# EAGLE design UV-LED (EAGLE 6.5.0)
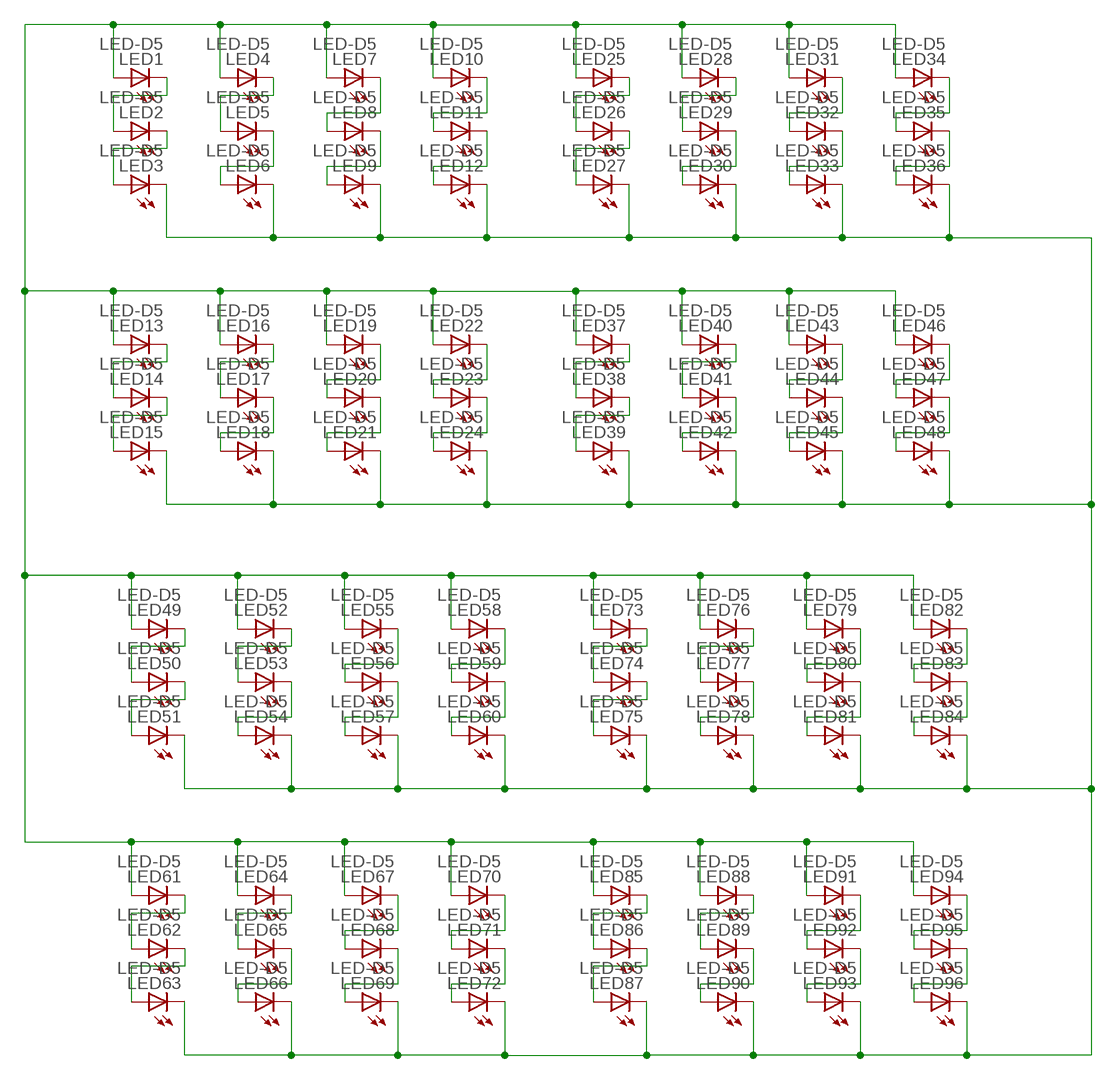
[diagram p0: schematic, sheet 1]

## Parts
LED1  LED-D5  [LED-D5]
LED2  LED-D5  [LED-D5]
LED3  LED-D5  [LED-D5]
LED4  LED-D5  [LED-D5]
LED5  LED-D5  [LED-D5]
LED6  LED-D5  [LED-D5]
LED7  LED-D5  [LED-D5]
LED8  LED-D5  [LED-D5]
LED9  LED-D5  [LED-D5]
LED10  LED-D5  [LED-D5]
LED11  LED-D5  [LED-D5]
LED12  LED-D5  [LED-D5]
LED13  LED-D5  [LED-D5]
LED14  LED-D5  [LED-D5]
LED15  LED-D5  [LED-D5]
LED16  LED-D5  [LED-D5]
LED17  LED-D5  [LED-D5]
LED18  LED-D5  [LED-D5]
LED19  LED-D5  [LED-D5]
LED20  LED-D5  [LED-D5]
LED21  LED-D5  [LED-D5]
LED22  LED-D5  [LED-D5]
LED23  LED-D5  [LED-D5]
LED24  LED-D5  [LED-D5]
LED25  LED-D5  [LED-D5]
LED26  LED-D5  [LED-D5]
LED27  LED-D5  [LED-D5]
LED28  LED-D5  [LED-D5]
LED29  LED-D5  [LED-D5]
LED30  LED-D5  [LED-D5]
LED31  LED-D5  [LED-D5]
LED32  LED-D5  [LED-D5]
LED33  LED-D5  [LED-D5]
LED34  LED-D5  [LED-D5]
LED35  LED-D5  [LED-D5]
LED36  LED-D5  [LED-D5]
LED37  LED-D5  [LED-D5]
LED38  LED-D5  [LED-D5]
LED39  LED-D5  [LED-D5]
LED40  LED-D5  [LED-D5]
LED41  LED-D5  [LED-D5]
LED42  LED-D5  [LED-D5]
LED43  LED-D5  [LED-D5]
LED44  LED-D5  [LED-D5]
LED45  LED-D5  [LED-D5]
LED46  LED-D5  [LED-D5]
LED47  LED-D5  [LED-D5]
LED48  LED-D5  [LED-D5]
LED49  LED-D5  [LED-D5]
LED50  LED-D5  [LED-D5]
LED51  LED-D5  [LED-D5]
LED52  LED-D5  [LED-D5]
LED53  LED-D5  [LED-D5]
LED54  LED-D5  [LED-D5]
LED55  LED-D5  [LED-D5]
LED56  LED-D5  [LED-D5]
LED57  LED-D5  [LED-D5]
LED58  LED-D5  [LED-D5]
LED59  LED-D5  [LED-D5]
LED60  LED-D5  [LED-D5]
LED61  LED-D5  [LED-D5]
LED62  LED-D5  [LED-D5]
LED63  LED-D5  [LED-D5]
LED64  LED-D5  [LED-D5]
LED65  LED-D5  [LED-D5]
LED66  LED-D5  [LED-D5]
LED67  LED-D5  [LED-D5]
LED68  LED-D5  [LED-D5]
LED69  LED-D5  [LED-D5]
LED70  LED-D5  [LED-D5]
LED71  LED-D5  [LED-D5]
LED72  LED-D5  [LED-D5]
LED73  LED-D5  [LED-D5]
LED74  LED-D5  [LED-D5]
LED75  LED-D5  [LED-D5]
LED76  LED-D5  [LED-D5]
LED77  LED-D5  [LED-D5]
LED78  LED-D5  [LED-D5]
LED79  LED-D5  [LED-D5]
LED80  LED-D5  [LED-D5]
LED81  LED-D5  [LED-D5]
LED82  LED-D5  [LED-D5]
LED83  LED-D5  [LED-D5]
LED84  LED-D5  [LED-D5]
LED85  LED-D5  [LED-D5]
LED86  LED-D5  [LED-D5]
LED87  LED-D5  [LED-D5]
LED88  LED-D5  [LED-D5]
LED89  LED-D5  [LED-D5]
LED90  LED-D5  [LED-D5]
LED91  LED-D5  [LED-D5]
LED92  LED-D5  [LED-D5]
LED93  LED-D5  [LED-D5]
LED94  LED-D5  [LED-D5]
LED95  LED-D5  [LED-D5]
LED96  LED-D5  [LED-D5]

## Nets
N$1: LED1.A LED4.A LED7.A LED10.A LED13.A LED16.A LED19.A LED22.A LED25.A LED28.A LED31.A LED34.A LED37.A LED40.A LED43.A LED46.A LED49.A LED52.A LED55.A LED58.A LED61.A LED64.A LED67.A LED70.A LED73.A LED76.A LED79.A LED82.A LED85.A LED88.A LED91.A LED94.A
N$3: LED1.C LED2.A
N$4: LED2.C LED3.A
N$5: LED4.C LED5.A
N$6: LED5.C LED6.A
N$7: LED7.C LED8.A
N$8: LED8.C LED9.A
N$9: LED10.C LED11.A
N$10: LED11.C LED12.A
N$13: LED13.C LED14.A
N$14: LED14.C LED15.A
N$15: LED16.C LED17.A
N$16: LED17.C LED18.A
N$17: LED19.C LED20.A
N$18: LED20.C LED21.A
N$19: LED22.C LED23.A
N$20: LED23.C LED24.A
N$22: LED3.C LED6.C LED9.C LED12.C LED15.C LED18.C LED21.C LED24.C LED27.C LED30.C LED33.C LED36.C LED39.C LED42.C LED45.C LED48.C LED51.C LED54.C LED57.C LED60.C LED63.C LED66.C LED69.C LED72.C LED75.C LED78.C LED81.C LED84.C LED87.C LED90.C LED93.C LED96.C
N$23: LED25.C LED26.A
N$24: LED26.C LED27.A
N$25: LED28.C LED29.A
N$26: LED29.C LED30.A
N$27: LED31.C LED32.A
N$28: LED32.C LED33.A
N$29: LED34.C LED35.A
N$30: LED35.C LED36.A
N$33: LED37.C LED38.A
N$34: LED38.C LED39.A
N$35: LED40.C LED41.A
N$36: LED41.C LED42.A
N$37: LED43.C LED44.A
N$38: LED44.C LED45.A
N$39: LED46.C LED47.A
N$40: LED47.C LED48.A
N$43: LED49.C LED50.A
N$44: LED50.C LED51.A
N$45: LED52.C LED53.A
N$46: LED53.C LED54.A
N$47: LED55.C LED56.A
N$48: LED56.C LED57.A
N$49: LED58.C LED59.A
N$50: LED59.C LED60.A
N$53: LED61.C LED62.A
N$54: LED62.C LED63.A
N$55: LED64.C LED65.A
N$56: LED65.C LED66.A
N$57: LED67.C LED68.A
N$58: LED68.C LED69.A
N$59: LED70.C LED71.A
N$60: LED71.C LED72.A
N$63: LED73.C LED74.A
N$64: LED74.C LED75.A
N$65: LED76.C LED77.A
N$66: LED77.C LED78.A
N$67: LED79.C LED80.A
N$68: LED80.C LED81.A
N$69: LED82.C LED83.A
N$70: LED83.C LED84.A
N$73: LED85.C LED86.A
N$74: LED86.C LED87.A
N$75: LED88.C LED89.A
N$76: LED89.C LED90.A
N$77: LED91.C LED92.A
N$78: LED92.C LED93.A
N$79: LED94.C LED95.A
N$80: LED95.C LED96.A

## Library data of the parts
LED1-LED96 = usb:LED-D5

## Board
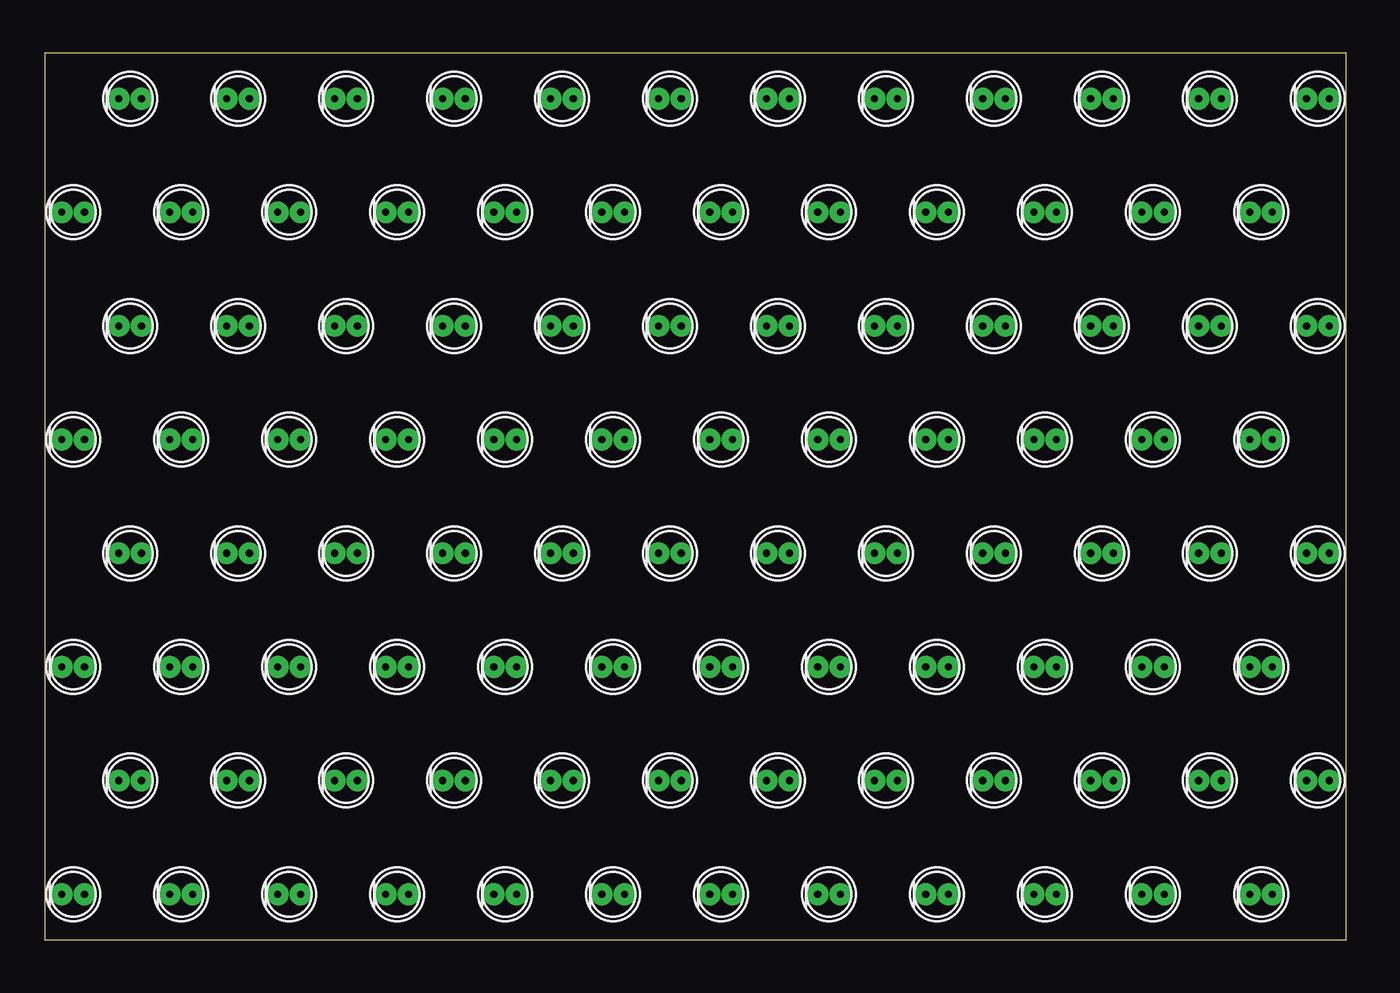
[diagram p1: board, top side]
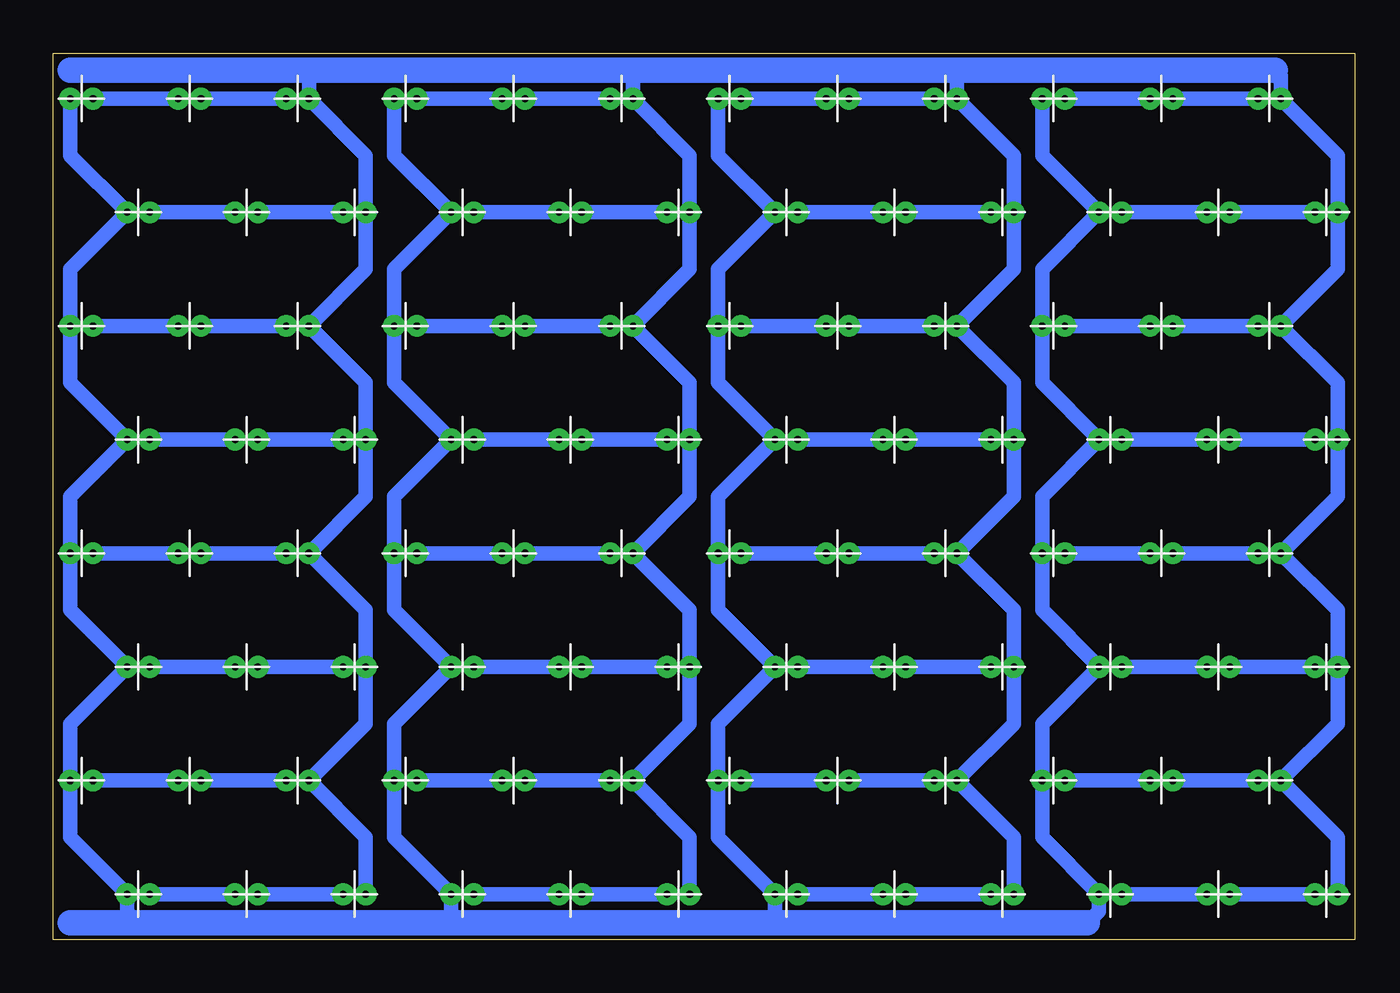
[diagram p2: board, bottom side, seen from below]

Size 72.69 x 49.52 mm. Coordinates in mm from the lower left corner, seen from the top.
Outline: 0,0 72.69,0 72.69,49.52 0,49.52 0,0
Copper layers (1*16): Top 0.035mm / dielectric 1.5mm / Bottom 0.035mm
Design rules "default": minimum track width 12mil, minimum drill 32mil, track to track 12mil, track to pad 12mil, pad to pad 12mil, via to via 12mil, smd to smd 8mil, copper to edge 40mil, drill to drill 8mil, minimum pad ring 16mil, minimum via ring 12mil, stop-mask expansion 4mil, vias tented up to drill 0mil, thermal gap 20mil

### Footprints (pad centres in the part's own frame; a part is rotated, then mirrored left to right if it is on the bottom)
LED-D5 = drill 0.4 pad 0.965: A 0.635,0; C -0.635,0

### Placement (x,y rotation side)
LED1  67.94,2.54 0 top
LED2  61.91,2.54 0 top
LED3  55.88,2.54 0 top
LED4  49.85,2.54 0 top
LED5  43.81,2.54 0 top
LED6  37.78,2.54 0 top
LED7  31.75,2.54 0 top
LED8  25.72,2.54 0 top
LED9  19.68,2.54 0 top
LED10  13.65,2.54 0 top
LED11  7.62,2.54 0 top
LED12  1.59,2.54 0 top
LED13  16.83,8.89 0 top
LED14  10.79,8.89 0 top
LED15  4.76,8.89 0 top
LED16  34.92,8.89 0 top
LED17  28.89,8.89 0 top
LED18  22.86,8.89 0 top
LED19  53.02,8.89 0 top
LED20  46.99,8.89 0 top
LED21  40.96,8.89 0 top
LED22  71.12,8.89 0 top
LED23  65.09,8.89 0 top
LED24  59.05,8.89 0 top
LED25  13.65,15.24 0 top
LED26  7.62,15.24 0 top
LED27  1.59,15.24 0 top
LED28  31.75,15.24 0 top
LED29  25.72,15.24 0 top
LED30  19.68,15.24 0 top
LED31  49.85,15.24 0 top
LED32  43.81,15.24 0 top
LED33  37.78,15.24 0 top
LED34  67.94,15.24 0 top
LED35  61.91,15.24 0 top
LED36  55.88,15.24 0 top
LED37  16.83,21.59 0 top
LED38  10.79,21.59 0 top
LED39  4.76,21.59 0 top
LED40  34.92,21.59 0 top
LED41  28.89,21.59 0 top
LED42  22.86,21.59 0 top
LED43  53.02,21.59 0 top
LED44  46.99,21.59 0 top
LED45  40.96,21.59 0 top
LED46  71.12,21.59 0 top
LED47  65.09,21.59 0 top
LED48  59.05,21.59 0 top
LED49  13.65,27.94 0 top
LED50  7.62,27.94 0 top
LED51  1.59,27.94 0 top
LED52  31.75,27.94 0 top
LED53  25.72,27.94 0 top
LED54  19.68,27.94 0 top
LED55  49.85,27.94 0 top
LED56  43.81,27.94 0 top
LED57  37.78,27.94 0 top
LED58  67.94,27.94 0 top
LED59  61.91,27.94 0 top
LED60  55.88,27.94 0 top
LED61  16.83,34.29 0 top
LED62  10.79,34.29 0 top
LED63  4.76,34.29 0 top
LED64  34.92,34.29 0 top
LED65  28.89,34.29 0 top
LED66  22.86,34.29 0 top
LED67  53.02,34.29 0 top
LED68  46.99,34.29 0 top
LED69  40.96,34.29 0 top
LED70  71.12,34.29 0 top
LED71  65.09,34.29 0 top
LED72  59.05,34.29 0 top
LED73  13.65,40.64 0 top
LED74  7.62,40.64 0 top
LED75  1.59,40.64 0 top
LED76  31.75,40.64 0 top
LED77  25.72,40.64 0 top
LED78  19.68,40.64 0 top
LED79  49.85,40.64 0 top
LED80  43.81,40.64 0 top
LED81  37.78,40.64 0 top
LED82  67.94,40.64 0 top
LED83  61.91,40.64 0 top
LED84  55.88,40.64 0 top
LED85  16.83,46.99 0 top
LED86  10.79,46.99 0 top
LED87  4.76,46.99 0 top
LED88  34.92,46.99 0 top
LED89  28.89,46.99 0 top
LED90  22.86,46.99 0 top
LED91  53.02,46.99 0 top
LED92  46.99,46.99 0 top
LED93  40.96,46.99 0 top
LED94  71.12,46.99 0 top
LED95  65.09,46.99 0 top
LED96  59.05,46.99 0 top

### Tracks (layer width: path | path; a pad name or v marks a point on that pad's centre or on a via)
N$1
  Bottom 0.813: LED85.A 17.46,43.81 LED73.A 17.46,37.47 LED61.A 17.46,31.11 LED49.A 17.46,24.77 LED37.A 17.46,18.41 LED25.A 17.46,12.06 LED13.A 17.46,5.71 LED10.A 14.29,1.59 14.92,0.95 | LED88.A 35.56,43.81 LED76.A 35.56,37.47 LED64.A 35.56,31.11 LED52.A 35.56,24.77 LED40.A 35.56,18.41 LED28.A 35.56,12.06 LED16.A 35.56,5.71 LED7.A 32.38,0.95 | LED91.A 53.66,43.81 LED79.A 53.66,37.47 LED67.A 53.66,31.11 LED55.A 53.66,24.77 LED43.A 53.66,18.41 LED31.A 53.66,12.06 LED19.A 53.66,5.71 LED4.A 50.48,0.95 | LED94.A 71.75,43.81 LED82.A 71.75,37.47 LED70.A 71.75,31.11 LED58.A 71.75,24.77 LED46.A 71.75,18.41 LED34.A 71.75,12.06 LED22.A 71.75,5.71 LED1.A 68.58,1.27 68.9,0.95
  Bottom 1.422: 14.92,0.95 32.38,0.95 50.48,0.95 68.9,0.95 71.75,0.95
N$3
  Bottom 0.813: LED2.A LED1.C
N$4
  Bottom 0.813: LED3.A LED2.C
N$5
  Bottom 0.813: LED5.A LED4.C
N$6
  Bottom 0.813: LED6.A LED5.C
N$7
  Bottom 0.813: LED8.A LED7.C
N$8
  Bottom 0.813: LED9.A LED8.C
N$9
  Bottom 0.813: LED11.A LED10.C
N$10
  Bottom 0.813: LED12.A LED11.C
N$13
  Bottom 0.813: LED14.A LED13.C
N$14
  Bottom 0.813: LED15.A LED14.C
N$15
  Bottom 0.813: LED17.A LED16.C
N$16
  Bottom 0.813: LED18.A LED17.C
N$17
  Bottom 0.813: LED20.A LED19.C
N$18
  Bottom 0.813: LED21.A LED20.C
N$19
  Bottom 0.813: LED23.A LED22.C
N$20
  Bottom 0.813: LED24.A LED23.C
N$22
  Bottom 0.813: LED12.C 0.95,5.71 LED15.C 0.95,12.06 LED27.C 0.95,18.41 LED39.C 0.95,24.77 LED51.C 0.95,31.11 LED63.C 0.95,37.47 LED75.C 0.95,43.81 LED87.C 4.13,48.26 4.45,48.58 | LED9.C 19.05,5.71 LED18.C 19.05,12.06 LED30.C 19.05,18.41 LED42.C 19.05,24.77 LED54.C 19.05,31.11 LED66.C 19.05,37.47 LED78.C 19.05,43.81 LED90.C 22.23,48.58 | LED6.C 37.15,5.71 LED21.C 37.15,12.06 LED33.C 37.15,18.41 LED45.C 37.15,24.77 LED57.C 37.15,31.11 LED69.C 37.15,37.47 LED81.C 37.15,43.81 LED93.C 40.32,48.26 41.91,48.58 | LED3.C 55.24,5.71 LED24.C 55.24,12.06 LED36.C 55.24,18.41 LED48.C 55.24,24.77 LED60.C 55.24,31.11 LED72.C 55.24,37.47 LED84.C 55.24,43.81 LED96.C 58.42,48.58
  Bottom 1.422: 4.45,48.58 22.23,48.58 41.91,48.58 58.42,48.58 71.75,48.58
N$23
  Bottom 0.813: LED26.A LED25.C
N$24
  Bottom 0.813: LED27.A LED26.C
N$25
  Bottom 0.813: LED29.A LED28.C
N$26
  Bottom 0.813: LED29.C LED30.A
N$27
  Bottom 0.813: LED32.A LED31.C
N$28
  Bottom 0.813: LED33.A LED32.C
N$29
  Bottom 0.813: LED35.A LED34.C
N$30
  Bottom 0.813: LED36.A LED35.C
N$33
  Bottom 0.813: LED38.A LED37.C
N$34
  Bottom 0.813: LED39.A LED38.C
N$35
  Bottom 0.813: LED41.A LED40.C
N$36
  Bottom 0.813: LED42.A LED41.C
N$37
  Bottom 0.813: LED44.A LED43.C
N$38
  Bottom 0.813: LED45.A LED44.C
N$39
  Bottom 0.813: LED47.A LED46.C
N$40
  Bottom 0.813: LED48.A LED47.C
N$43
  Bottom 0.813: LED50.A LED49.C
N$44
  Bottom 0.813: LED51.A LED50.C
N$45
  Bottom 0.813: LED53.A LED52.C
N$46
  Bottom 0.813: LED54.A LED53.C
N$47
  Bottom 0.813: LED56.A LED55.C
N$48
  Bottom 0.813: LED57.A LED56.C
N$49
  Bottom 0.813: LED59.A LED58.C
N$50
  Bottom 0.813: LED60.A LED59.C
N$53
  Bottom 0.813: LED62.A LED61.C
N$54
  Bottom 0.813: LED63.A LED62.C
N$55
  Bottom 0.813: LED65.A LED64.C
N$56
  Bottom 0.813: LED66.A LED65.C
N$57
  Bottom 0.813: LED68.A LED67.C
N$58
  Bottom 0.813: LED69.A LED68.C
N$59
  Bottom 0.813: LED71.A LED70.C
N$60
  Bottom 0.813: LED72.A LED71.C
N$63
  Bottom 0.813: LED74.A LED73.C
N$64
  Bottom 0.813: LED75.A LED74.C
N$65
  Bottom 0.813: LED77.A LED76.C
N$66
  Bottom 0.813: LED78.A LED77.C
N$67
  Bottom 0.813: LED80.A LED79.C
N$68
  Bottom 0.813: LED81.A LED80.C
N$69
  Bottom 0.813: LED83.A LED82.C
N$70
  Bottom 0.813: LED84.A LED83.C
N$73
  Bottom 0.813: LED86.A LED85.C
N$74
  Bottom 0.813: LED87.A LED86.C
N$75
  Bottom 0.813: LED88.C LED89.A
N$76
  Bottom 0.813: LED90.A LED89.C
N$77
  Bottom 0.813: LED91.C LED92.A
N$78
  Bottom 0.813: LED93.A LED92.C
N$79
  Bottom 0.813: LED94.C LED95.A
N$80
  Bottom 0.813: LED96.A LED95.C